# Altium schematic sheet Analog_Signals.SchDoc
size A4; CompanyName: Technische Hochschule Nürnberg Georg Simon Ohm; Organization: UltraZohm; Address1: Kesslerplatz 12; Address2: 90489 Nürnberg; Address3: GERMANY; DocumentNumber: 2; SheetNumber: 2; SheetTotal: 6; Website: www.ultrazohm.com
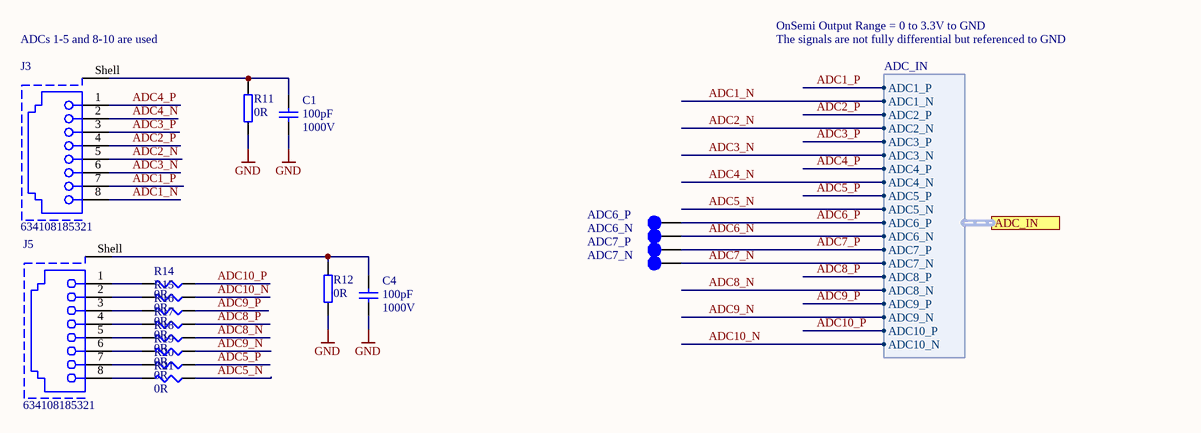
[diagram p0: Analog_Signals.SchDoc]

## Parts
ADC6_N  ADC6_N  [TP_1mm]  (value not drawn)  (no BOM)
ADC6_P  ADC6_P  [TP_1mm]  (value not drawn)  (no BOM)
ADC7_N  ADC7_N  [TP_1mm]  (value not drawn)  (no BOM)
ADC7_P  ADC7_P  [TP_1mm]  (value not drawn)  (no BOM)
C1  100pF  Voltage: 1000V  [C_1206]
C4  100pF  Voltage: 1000V  [C_1206]
J3  634108185321  [634108185321]
J5  634108185321  [634108185321]
R11  0R  [RESC1608X06N]
R12  0R  [RESC1608X06N]
R14  0R  [RESC0603]
R15  0R  [RESC0603]
R16  0R  [RESC0603]
R17  0R  [RESC0603]
R18  0R  [RESC0603]
R19  0R  [RESC0603]
R20  0R  [RESC0603]
R21  0R  [RESC0603]

## Ports
ADC_IN (harness ADC_IN)

## Harnesses
ADC_IN: ADC10_N, ADC10_P, ADC1_N, ADC1_P, ADC2_N, ADC2_P, ADC3_N, ADC3_P, ADC4_N, ADC4_P, ADC5_N, ADC5_P, ADC6_N, ADC6_P, ADC7_N, ADC7_P, ADC8_N, ADC8_P, ADC9_N, ADC9_P

## Nets
GND: C1.1 C4.1 R11.1 R12.1
ADC1_N: J3.8 ; port ADC_IN.ADC1_N
ADC1_P: J3.7 ; port ADC_IN.ADC1_P
ADC2_N: J3.5 ; port ADC_IN.ADC2_N
ADC2_P: J3.4 ; port ADC_IN.ADC2_P
ADC3_N: J3.6 ; port ADC_IN.ADC3_N
ADC3_P: J3.3 ; port ADC_IN.ADC3_P
ADC4_N: J3.2 ; port ADC_IN.ADC4_N
ADC4_P: J3.1 ; port ADC_IN.ADC4_P
ADC5_N: R21.1 ; port ADC_IN.ADC5_N
ADC5_P: R20.1 ; port ADC_IN.ADC5_P
ADC6_N: ADC6_N.1 ; port ADC_IN.ADC6_N
ADC6_P: ADC6_P.1 ; port ADC_IN.ADC6_P
ADC7_N: ADC7_N.1 ; port ADC_IN.ADC7_N
ADC7_P: ADC7_P.1 ; port ADC_IN.ADC7_P
ADC8_N: R18.1 ; port ADC_IN.ADC8_N
ADC8_P: R17.1 ; port ADC_IN.ADC8_P
ADC9_N: R19.1 ; port ADC_IN.ADC9_N
ADC9_P: R16.1 ; port ADC_IN.ADC9_P
ADC10_N: R15.1 ; port ADC_IN.ADC10_N
ADC10_P: R14.1 ; port ADC_IN.ADC10_P
NetC1_2: C1.2 J3.Shell R11.2
NetC4_2: C4.2 J5.Shell R12.2
NetJ5_1: J5.1 R14.2
NetJ5_2: J5.2 R15.2
NetJ5_3: J5.3 R16.2
NetJ5_4: J5.4 R17.2
NetJ5_5: J5.5 R18.2
NetJ5_6: J5.6 R19.2
NetJ5_7: J5.7 R20.2
NetJ5_8: J5.8 R21.2

## Notes on the sheet
- (near J3) ADCs 1-5 and 8-10 are used
- OnSemi Output Range = 0 to 3.3V to GND
- The signals are not fully differential but referenced to GND
- Title
- Revision:
- Design Engineer:
- Date:
- Project:
- Sheet
- of

## Library data of the parts
ADC6_N ADC6_P ADC7_N ADC7_P = TP_1mm: Testpoint 1mm; Created: 2018_06_25_AGeiger; Value: Testpoint 1mm
C1 C4 = C_1206: Capacitor 1206; MPN: 885342008009; Tolerance: 5%; MF: Würth Elektronik; Dielectric: C0G; Package: 1206; Value: 100pF; Created: 2018_06_25_AGeiger; Supplier 1: Mouser; Supplier Part Number 1: 710-885342008009
J3 J5 = 634108185321: WR-MJ Modular Jack SMT Vertical Shielded with Solder Tab 8P8C Top Entry; Manufacturer: Wurth Elektronik; Rated Current: 1.5A; Contact Resistance: 30mOhm; Insulation Resistance: 1000MOhm; Working Voltage: 125VAC; Withstanding Voltage: 1000VAC; ComponentLink1Description: Manufacturer; ComponentLink1URL: http://www.we-online.de; ComponentLink2Description: Datasheet; ComponentLink2URL: https://katalog.we-online.com/em/datasheet/634108185321.pdf; Packaging: Tape and Reel; Mounting Technology: SMT; Operating Temperature: -40 to +85degC; Manufacturer Part Number: 634108185321; Published Date: September 2020; xPxC: 8P8C; Type: Vertical
R11 R12 = R_0603: MPN: CRCW06031M00FKEAC; MF: Vishay / Dale; Tolerance: 1%; Value: 0R; Supplier 1: mouser; Supplier Part Number 1: 71-CRCW06031M00FKEAC; Package: 0603
R14-R21 = RES_SMD: RES SMD; Part Number: Generic 1% tol.; VALUE: 0R; Publisher: Generic